# EAGLE schematic 5V STEPDOWN (EAGLE 9.6.2)
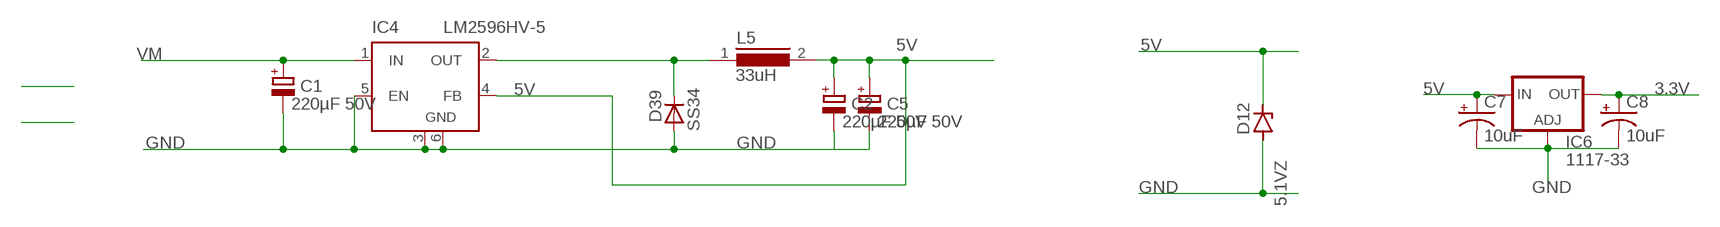
[diagram p0: schematic, sheet 1]

## Parts
C1  220µF 50V  CPOL-EUE3.5-8  [E3,5-8]
C2  220µF 50V  CPOL-EUE3.5-8  [E3,5-8]
C5  220µF 50V  CPOL-EUE3.5-8  [E3,5-8]
C7  10uF  CAP_POLPTH2  [CPOL-RADIAL-10UF-25V]
C8  10uF  CAP_POLPTH2  [CPOL-RADIAL-10UF-25V]
D12  5.1VZ  ZENER-DIODESMB  [SMB]
D39  SS34  D-SOD-87  [SOD87]
IC4  LM2596HV-5  LM2596S  [TO263-5]
IC6  1117-33  LD117AS33TR  [SOT223]
L5  33uH  DR127  [DR127]

## Nets
3.3V: C8.1(+) IC6.4(OUT)
5V: C2.+ C5.+ C7.1(+) D12.C IC4.4(FB) IC6.3(IN) L5.2
GND: C1.- C2.- C5.- C7.2(-) C8.2(-) D12.A D39.2(A) IC4.3(GND) IC4.5(EN) IC4.6(GND) IC6.1(ADJ)
N$164: D39.1(C) IC4.2(OUT) L5.1
VM: C1.+ IC4.1(IN)

## Library data of the parts
C1 C2 C5 = resistor:CPOL-EU: POLARIZED CAPACITOR, European symbol
C7 C8 = SparkFun:CAP_POL: Capacitor Polarized These are standard SMD and PTH capacitors. Normally 10uF, 47uF, and 100uF in electrolytic and tantalum varieties. Always verify the external diameter of the through hole cap, it varies with capacity, voltage, and manufacturer. The EIA devices should be standard.
D12 = diode:ZENER-DIODE: Z-Diode
D39 = semicon-smd-ipc:D-: DIODE unfilled
IC4 = linear:LM2596S: STEP-DOWN VOLTAGE REGULATOR
IC6 = v-reg:LD117A?*: Low drop fixed and adjustable positive voltage regulators 1 A Source: http://www.st.com/stonline/products/literature/ds/7194/ld1117axx.pdf
L5 = inductors:DR127: High Power Density, High Efficiency, Shielded Inductors Source: coiltronics_dr_series.pdf

## Net classes
0 default: width 0.203 mm, clearance 0.152 mm